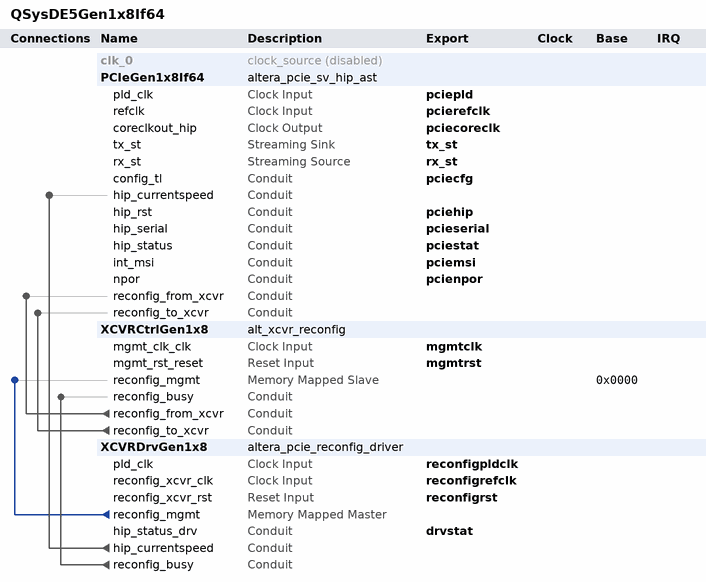
[diagram p0: system contents]
# Platform Designer (Qsys) system QSysDE5Gen1x8If64, Stratix V 5SGXEA7N2F45C2
# Parameters at their usual value, and those the tool derives, are not listed.
package require -exact qsys 14.1
create_system QSysDE5Gen1x8If64
set_project_property DEVICE_FAMILY {Stratix V}
set_project_property DEVICE 5SGXEA7N2F45C2

add_instance clk_0 clock_source 14.1
set_instance_property clk_0 ENABLED false
set_instance_parameter_value clk_0 clockFrequency 50000000

add_instance PCIeGen1x8If64 altera_pcie_sv_hip_ast 14.1
set_instance_parameter_value PCIeGen1x8If64 advanced_default_hwtcl_atomic_malformed true
set_instance_parameter_value PCIeGen1x8If64 advanced_default_hwtcl_atomic_op_completer_32bit false
set_instance_parameter_value PCIeGen1x8If64 advanced_default_hwtcl_atomic_op_completer_64bit false
set_instance_parameter_value PCIeGen1x8If64 advanced_default_hwtcl_atomic_op_routing false
set_instance_parameter_value PCIeGen1x8If64 advanced_default_hwtcl_bridge_port_ssid_support false
set_instance_parameter_value PCIeGen1x8If64 advanced_default_hwtcl_bridge_port_vga_enable false
set_instance_parameter_value PCIeGen1x8If64 advanced_default_hwtcl_bypass_cdc false
set_instance_parameter_value PCIeGen1x8If64 advanced_default_hwtcl_cas_completer_128bit false
set_instance_parameter_value PCIeGen1x8If64 advanced_default_hwtcl_cdc_dummy_insert_limit 11
set_instance_parameter_value PCIeGen1x8If64 advanced_default_hwtcl_d0_pme false
set_instance_parameter_value PCIeGen1x8If64 advanced_default_hwtcl_d1_pme false
set_instance_parameter_value PCIeGen1x8If64 advanced_default_hwtcl_d1_support false
set_instance_parameter_value PCIeGen1x8If64 advanced_default_hwtcl_d2_pme false
set_instance_parameter_value PCIeGen1x8If64 advanced_default_hwtcl_d2_support false
set_instance_parameter_value PCIeGen1x8If64 advanced_default_hwtcl_d3_cold_pme false
set_instance_parameter_value PCIeGen1x8If64 advanced_default_hwtcl_d3_hot_pme false
set_instance_parameter_value PCIeGen1x8If64 advanced_default_hwtcl_data_pack_rx disable
set_instance_parameter_value PCIeGen1x8If64 advanced_default_hwtcl_deskew_comma com_deskw
set_instance_parameter_value PCIeGen1x8If64 advanced_default_hwtcl_device_number 0
set_instance_parameter_value PCIeGen1x8If64 advanced_default_hwtcl_disable_link_x2_support false
set_instance_parameter_value PCIeGen1x8If64 advanced_default_hwtcl_disable_snoop_packet false
set_instance_parameter_value PCIeGen1x8If64 advanced_default_hwtcl_ei_delay_powerdown_count 10
set_instance_parameter_value PCIeGen1x8If64 advanced_default_hwtcl_eie_before_nfts_count 4
set_instance_parameter_value PCIeGen1x8If64 advanced_default_hwtcl_enable_adapter_half_rate_mode false
set_instance_parameter_value PCIeGen1x8If64 advanced_default_hwtcl_enable_l1_aspm false
set_instance_parameter_value PCIeGen1x8If64 advanced_default_hwtcl_enable_rx_buffer_checking false
set_instance_parameter_value PCIeGen1x8If64 advanced_default_hwtcl_extended_format_field false
set_instance_parameter_value PCIeGen1x8If64 advanced_default_hwtcl_extended_tag_reset false
set_instance_parameter_value PCIeGen1x8If64 advanced_default_hwtcl_fc_init_timer 1024
set_instance_parameter_value PCIeGen1x8If64 advanced_default_hwtcl_flow_control_timeout_count 200
set_instance_parameter_value PCIeGen1x8If64 advanced_default_hwtcl_flow_control_update_count 30
set_instance_parameter_value PCIeGen1x8If64 advanced_default_hwtcl_flr_capability false
set_instance_parameter_value PCIeGen1x8If64 advanced_default_hwtcl_gen2_diffclock_nfts_count 255
set_instance_parameter_value PCIeGen1x8If64 advanced_default_hwtcl_gen2_sameclock_nfts_count 255
set_instance_parameter_value PCIeGen1x8If64 advanced_default_hwtcl_hot_plug_support 0
set_instance_parameter_value PCIeGen1x8If64 advanced_default_hwtcl_interrupt_pin inta
set_instance_parameter_value PCIeGen1x8If64 advanced_default_hwtcl_l01_entry_latency 31
set_instance_parameter_value PCIeGen1x8If64 advanced_default_hwtcl_l0_exit_latency_diffclock 6
set_instance_parameter_value PCIeGen1x8If64 advanced_default_hwtcl_l0_exit_latency_sameclock 6
set_instance_parameter_value PCIeGen1x8If64 advanced_default_hwtcl_l1_exit_latency_diffclock 0
set_instance_parameter_value PCIeGen1x8If64 advanced_default_hwtcl_l1_exit_latency_sameclock 0
set_instance_parameter_value PCIeGen1x8If64 advanced_default_hwtcl_low_priority_vc single_vc
set_instance_parameter_value PCIeGen1x8If64 advanced_default_hwtcl_ltr_mechanism false
set_instance_parameter_value PCIeGen1x8If64 advanced_default_hwtcl_ltssm_1ms_timeout disable
set_instance_parameter_value PCIeGen1x8If64 advanced_default_hwtcl_ltssm_freqlocked_check disable
set_instance_parameter_value PCIeGen1x8If64 advanced_default_hwtcl_maximum_current 0
set_instance_parameter_value PCIeGen1x8If64 advanced_default_hwtcl_no_command_completed true
set_instance_parameter_value PCIeGen1x8If64 advanced_default_hwtcl_no_soft_reset false
set_instance_parameter_value PCIeGen1x8If64 advanced_default_hwtcl_pclk_out_sel pclk
set_instance_parameter_value PCIeGen1x8If64 advanced_default_hwtcl_pipex1_debug_sel disable
set_instance_parameter_value PCIeGen1x8If64 advanced_default_hwtcl_register_pipe_signals false
set_instance_parameter_value PCIeGen1x8If64 advanced_default_hwtcl_reserved_debug 0
set_instance_parameter_value PCIeGen1x8If64 advanced_default_hwtcl_retry_buffer_last_active_address 2047
set_instance_parameter_value PCIeGen1x8If64 advanced_default_hwtcl_rx_l0s_count_idl 0
set_instance_parameter_value PCIeGen1x8If64 advanced_default_hwtcl_set_l0s 0
set_instance_parameter_value PCIeGen1x8If64 advanced_default_hwtcl_skp_os_gen3_count 0
set_instance_parameter_value PCIeGen1x8If64 advanced_default_hwtcl_skp_os_schedule_count 0
set_instance_parameter_value PCIeGen1x8If64 advanced_default_hwtcl_ssid 0
set_instance_parameter_value PCIeGen1x8If64 advanced_default_hwtcl_ssvid 0
set_instance_parameter_value PCIeGen1x8If64 advanced_default_hwtcl_tph_completer false
set_instance_parameter_value PCIeGen1x8If64 advanced_default_hwtcl_tx_cdc_almost_empty 5
set_instance_parameter_value PCIeGen1x8If64 advanced_default_hwtcl_vc0_clk_enable true
set_instance_parameter_value PCIeGen1x8If64 advanced_default_hwtcl_wrong_device_id disable
set_instance_parameter_value PCIeGen1x8If64 advanced_default_parameter_override 0
set_instance_parameter_value PCIeGen1x8If64 ast_width_hwtcl {Avalon-ST 64-bit}
set_instance_parameter_value PCIeGen1x8If64 bar0_size_mask_hwtcl 10
set_instance_parameter_value PCIeGen1x8If64 bar0_type_hwtcl 2
set_instance_parameter_value PCIeGen1x8If64 bar1_size_mask_hwtcl 0
set_instance_parameter_value PCIeGen1x8If64 bar1_type_hwtcl 0
set_instance_parameter_value PCIeGen1x8If64 bar2_size_mask_hwtcl 0
set_instance_parameter_value PCIeGen1x8If64 bar2_type_hwtcl 0
set_instance_parameter_value PCIeGen1x8If64 bar3_size_mask_hwtcl 0
set_instance_parameter_value PCIeGen1x8If64 bar3_type_hwtcl 0
set_instance_parameter_value PCIeGen1x8If64 bar4_size_mask_hwtcl 0
set_instance_parameter_value PCIeGen1x8If64 bar4_type_hwtcl 0
set_instance_parameter_value PCIeGen1x8If64 bar5_size_mask_hwtcl 0
set_instance_parameter_value PCIeGen1x8If64 bar5_type_hwtcl 0
set_instance_parameter_value PCIeGen1x8If64 change_deemphasis_hwtcl 0
set_instance_parameter_value PCIeGen1x8If64 class_code_hwtcl 0
set_instance_parameter_value PCIeGen1x8If64 completion_timeout_hwtcl ABCD
set_instance_parameter_value PCIeGen1x8If64 design_environment_hwtcl QSYS
set_instance_parameter_value PCIeGen1x8If64 device_id_hwtcl 1
set_instance_parameter_value PCIeGen1x8If64 dll_active_report_support_hwtcl 0
set_instance_parameter_value PCIeGen1x8If64 ecrc_check_capable_hwtcl 0
set_instance_parameter_value PCIeGen1x8If64 ecrc_gen_capable_hwtcl 0
set_instance_parameter_value PCIeGen1x8If64 enable_completion_timeout_disable_hwtcl 1
set_instance_parameter_value PCIeGen1x8If64 enable_function_msix_support_hwtcl 0
set_instance_parameter_value PCIeGen1x8If64 enable_pcisigtest_hwtcl 0
set_instance_parameter_value PCIeGen1x8If64 enable_pipe32_phyip_ser_driver_hwtcl 0
set_instance_parameter_value PCIeGen1x8If64 enable_pipe32_sim_hwtcl 0
set_instance_parameter_value PCIeGen1x8If64 enable_power_on_rst_pulse_hwtcl 0
set_instance_parameter_value PCIeGen1x8If64 enable_slot_register_hwtcl 0
set_instance_parameter_value PCIeGen1x8If64 enable_tl_only_sim_hwtcl 0
set_instance_parameter_value PCIeGen1x8If64 endpoint_l0_latency_hwtcl 0
set_instance_parameter_value PCIeGen1x8If64 endpoint_l1_latency_hwtcl 0
set_instance_parameter_value PCIeGen1x8If64 expansion_base_address_register_hwtcl 0
set_instance_parameter_value PCIeGen1x8If64 extend_tag_field_hwtcl 64
set_instance_parameter_value PCIeGen1x8If64 fixed_preset_on 0
set_instance_parameter_value PCIeGen1x8If64 force_hrc 0
set_instance_parameter_value PCIeGen1x8If64 force_src 0
set_instance_parameter_value PCIeGen1x8If64 full_swing_hwtcl 35
set_instance_parameter_value PCIeGen1x8If64 gen123_lane_rate_mode_hwtcl {Gen1 (2.5 Gbps)}
set_instance_parameter_value PCIeGen1x8If64 gen3_coeff_10_ber_meas_hwtcl 0
set_instance_parameter_value PCIeGen1x8If64 gen3_coeff_10_hwtcl 0
set_instance_parameter_value PCIeGen1x8If64 gen3_coeff_10_nxtber_less_hwtcl g3_coeff_10_nxtber_less
set_instance_parameter_value PCIeGen1x8If64 gen3_coeff_10_nxtber_less_ptr_hwtcl 0
set_instance_parameter_value PCIeGen1x8If64 gen3_coeff_10_nxtber_more_hwtcl g3_coeff_10_nxtber_more
set_instance_parameter_value PCIeGen1x8If64 gen3_coeff_10_nxtber_more_ptr_hwtcl 0
set_instance_parameter_value PCIeGen1x8If64 gen3_coeff_10_preset_hint_hwtcl 0
set_instance_parameter_value PCIeGen1x8If64 gen3_coeff_10_reqber_hwtcl 0
set_instance_parameter_value PCIeGen1x8If64 gen3_coeff_10_sel_hwtcl preset_10
set_instance_parameter_value PCIeGen1x8If64 gen3_coeff_11_ber_meas_hwtcl 0
set_instance_parameter_value PCIeGen1x8If64 gen3_coeff_11_hwtcl 0
set_instance_parameter_value PCIeGen1x8If64 gen3_coeff_11_nxtber_less_hwtcl g3_coeff_11_nxtber_less
set_instance_parameter_value PCIeGen1x8If64 gen3_coeff_11_nxtber_less_ptr_hwtcl 0
set_instance_parameter_value PCIeGen1x8If64 gen3_coeff_11_nxtber_more_hwtcl g3_coeff_11_nxtber_more
set_instance_parameter_value PCIeGen1x8If64 gen3_coeff_11_nxtber_more_ptr_hwtcl 0
set_instance_parameter_value PCIeGen1x8If64 gen3_coeff_11_preset_hint_hwtcl 0
set_instance_parameter_value PCIeGen1x8If64 gen3_coeff_11_reqber_hwtcl 0
set_instance_parameter_value PCIeGen1x8If64 gen3_coeff_11_sel_hwtcl preset_11
set_instance_parameter_value PCIeGen1x8If64 gen3_coeff_12_ber_meas_hwtcl 0
set_instance_parameter_value PCIeGen1x8If64 gen3_coeff_12_hwtcl 0
set_instance_parameter_value PCIeGen1x8If64 gen3_coeff_12_nxtber_less_hwtcl g3_coeff_12_nxtber_less
set_instance_parameter_value PCIeGen1x8If64 gen3_coeff_12_nxtber_less_ptr_hwtcl 0
set_instance_parameter_value PCIeGen1x8If64 gen3_coeff_12_nxtber_more_hwtcl g3_coeff_12_nxtber_more
set_instance_parameter_value PCIeGen1x8If64 gen3_coeff_12_nxtber_more_ptr_hwtcl 0
set_instance_parameter_value PCIeGen1x8If64 gen3_coeff_12_preset_hint_hwtcl 0
set_instance_parameter_value PCIeGen1x8If64 gen3_coeff_12_reqber_hwtcl 0
set_instance_parameter_value PCIeGen1x8If64 gen3_coeff_12_sel_hwtcl preset_12
set_instance_parameter_value PCIeGen1x8If64 gen3_coeff_13_ber_meas_hwtcl 0
set_instance_parameter_value PCIeGen1x8If64 gen3_coeff_13_hwtcl 0
set_instance_parameter_value PCIeGen1x8If64 gen3_coeff_13_nxtber_less_hwtcl g3_coeff_13_nxtber_less
set_instance_parameter_value PCIeGen1x8If64 gen3_coeff_13_nxtber_less_ptr_hwtcl 0
set_instance_parameter_value PCIeGen1x8If64 gen3_coeff_13_nxtber_more_hwtcl g3_coeff_13_nxtber_more
set_instance_parameter_value PCIeGen1x8If64 gen3_coeff_13_nxtber_more_ptr_hwtcl 0
set_instance_parameter_value PCIeGen1x8If64 gen3_coeff_13_preset_hint_hwtcl 0
set_instance_parameter_value PCIeGen1x8If64 gen3_coeff_13_reqber_hwtcl 0
set_instance_parameter_value PCIeGen1x8If64 gen3_coeff_13_sel_hwtcl preset_13
set_instance_parameter_value PCIeGen1x8If64 gen3_coeff_14_ber_meas_hwtcl 0
set_instance_parameter_value PCIeGen1x8If64 gen3_coeff_14_hwtcl 0
set_instance_parameter_value PCIeGen1x8If64 gen3_coeff_14_nxtber_less_hwtcl g3_coeff_14_nxtber_less
set_instance_parameter_value PCIeGen1x8If64 gen3_coeff_14_nxtber_less_ptr_hwtcl 0
set_instance_parameter_value PCIeGen1x8If64 gen3_coeff_14_nxtber_more_hwtcl g3_coeff_14_nxtber_more
set_instance_parameter_value PCIeGen1x8If64 gen3_coeff_14_nxtber_more_ptr_hwtcl 0
set_instance_parameter_value PCIeGen1x8If64 gen3_coeff_14_preset_hint_hwtcl 0
set_instance_parameter_value PCIeGen1x8If64 gen3_coeff_14_reqber_hwtcl 0
set_instance_parameter_value PCIeGen1x8If64 gen3_coeff_14_sel_hwtcl preset_14
set_instance_parameter_value PCIeGen1x8If64 gen3_coeff_15_ber_meas_hwtcl 0
set_instance_parameter_value PCIeGen1x8If64 gen3_coeff_15_hwtcl 0
set_instance_parameter_value PCIeGen1x8If64 gen3_coeff_15_nxtber_less_hwtcl g3_coeff_15_nxtber_less
set_instance_parameter_value PCIeGen1x8If64 gen3_coeff_15_nxtber_less_ptr_hwtcl 0
set_instance_parameter_value PCIeGen1x8If64 gen3_coeff_15_nxtber_more_hwtcl g3_coeff_15_nxtber_more
set_instance_parameter_value PCIeGen1x8If64 gen3_coeff_15_nxtber_more_ptr_hwtcl 0
set_instance_parameter_value PCIeGen1x8If64 gen3_coeff_15_preset_hint_hwtcl 0
set_instance_parameter_value PCIeGen1x8If64 gen3_coeff_15_reqber_hwtcl 0
set_instance_parameter_value PCIeGen1x8If64 gen3_coeff_15_sel_hwtcl preset_15
set_instance_parameter_value PCIeGen1x8If64 gen3_coeff_16_ber_meas_hwtcl 0
set_instance_parameter_value PCIeGen1x8If64 gen3_coeff_16_hwtcl 0
set_instance_parameter_value PCIeGen1x8If64 gen3_coeff_16_nxtber_less_hwtcl g3_coeff_16_nxtber_less
set_instance_parameter_value PCIeGen1x8If64 gen3_coeff_16_nxtber_less_ptr_hwtcl 0
set_instance_parameter_value PCIeGen1x8If64 gen3_coeff_16_nxtber_more_hwtcl g3_coeff_16_nxtber_more
set_instance_parameter_value PCIeGen1x8If64 gen3_coeff_16_nxtber_more_ptr_hwtcl 0
set_instance_parameter_value PCIeGen1x8If64 gen3_coeff_16_preset_hint_hwtcl 0
set_instance_parameter_value PCIeGen1x8If64 gen3_coeff_16_reqber_hwtcl 0
set_instance_parameter_value PCIeGen1x8If64 gen3_coeff_16_sel_hwtcl preset_16
set_instance_parameter_value PCIeGen1x8If64 gen3_coeff_17_ber_meas_hwtcl 0
set_instance_parameter_value PCIeGen1x8If64 gen3_coeff_17_hwtcl 0
set_instance_parameter_value PCIeGen1x8If64 gen3_coeff_17_nxtber_less_hwtcl g3_coeff_17_nxtber_less
set_instance_parameter_value PCIeGen1x8If64 gen3_coeff_17_nxtber_less_ptr_hwtcl 0
set_instance_parameter_value PCIeGen1x8If64 gen3_coeff_17_nxtber_more_hwtcl g3_coeff_17_nxtber_more
set_instance_parameter_value PCIeGen1x8If64 gen3_coeff_17_nxtber_more_ptr_hwtcl 0
set_instance_parameter_value PCIeGen1x8If64 gen3_coeff_17_preset_hint_hwtcl 0
set_instance_parameter_value PCIeGen1x8If64 gen3_coeff_17_reqber_hwtcl 0
set_instance_parameter_value PCIeGen1x8If64 gen3_coeff_17_sel_hwtcl preset_17
set_instance_parameter_value PCIeGen1x8If64 gen3_coeff_18_ber_meas_hwtcl 0
set_instance_parameter_value PCIeGen1x8If64 gen3_coeff_18_hwtcl 0
set_instance_parameter_value PCIeGen1x8If64 gen3_coeff_18_nxtber_less_hwtcl g3_coeff_18_nxtber_less
set_instance_parameter_value PCIeGen1x8If64 gen3_coeff_18_nxtber_less_ptr_hwtcl 0
set_instance_parameter_value PCIeGen1x8If64 gen3_coeff_18_nxtber_more_hwtcl g3_coeff_18_nxtber_more
set_instance_parameter_value PCIeGen1x8If64 gen3_coeff_18_nxtber_more_ptr_hwtcl 0
set_instance_parameter_value PCIeGen1x8If64 gen3_coeff_18_preset_hint_hwtcl 0
set_instance_parameter_value PCIeGen1x8If64 gen3_coeff_18_reqber_hwtcl 0
set_instance_parameter_value PCIeGen1x8If64 gen3_coeff_18_sel_hwtcl preset_18
set_instance_parameter_value PCIeGen1x8If64 gen3_coeff_19_ber_meas_hwtcl 0
set_instance_parameter_value PCIeGen1x8If64 gen3_coeff_19_hwtcl 0
set_instance_parameter_value PCIeGen1x8If64 gen3_coeff_19_nxtber_less_hwtcl g3_coeff_19_nxtber_less
set_instance_parameter_value PCIeGen1x8If64 gen3_coeff_19_nxtber_less_ptr_hwtcl 0
set_instance_parameter_value PCIeGen1x8If64 gen3_coeff_19_nxtber_more_hwtcl g3_coeff_19_nxtber_more
set_instance_parameter_value PCIeGen1x8If64 gen3_coeff_19_nxtber_more_ptr_hwtcl 0
set_instance_parameter_value PCIeGen1x8If64 gen3_coeff_19_preset_hint_hwtcl 0
set_instance_parameter_value PCIeGen1x8If64 gen3_coeff_19_reqber_hwtcl 0
set_instance_parameter_value PCIeGen1x8If64 gen3_coeff_19_sel_hwtcl preset_19
set_instance_parameter_value PCIeGen1x8If64 gen3_coeff_1_ber_meas_hwtcl 2
set_instance_parameter_value PCIeGen1x8If64 gen3_coeff_1_hwtcl 7
set_instance_parameter_value PCIeGen1x8If64 gen3_coeff_1_nxtber_less_hwtcl g3_coeff_1_nxtber_less
set_instance_parameter_value PCIeGen1x8If64 gen3_coeff_1_nxtber_less_ptr_hwtcl 1
set_instance_parameter_value PCIeGen1x8If64 gen3_coeff_1_nxtber_more_hwtcl g3_coeff_1_nxtber_more
set_instance_parameter_value PCIeGen1x8If64 gen3_coeff_1_nxtber_more_ptr_hwtcl 1
set_instance_parameter_value PCIeGen1x8If64 gen3_coeff_1_preset_hint_hwtcl 0
set_instance_parameter_value PCIeGen1x8If64 gen3_coeff_1_reqber_hwtcl 0
set_instance_parameter_value PCIeGen1x8If64 gen3_coeff_1_sel_hwtcl preset_1
set_instance_parameter_value PCIeGen1x8If64 gen3_coeff_20_ber_meas_hwtcl 0
set_instance_parameter_value PCIeGen1x8If64 gen3_coeff_20_hwtcl 0
set_instance_parameter_value PCIeGen1x8If64 gen3_coeff_20_nxtber_less_hwtcl g3_coeff_20_nxtber_less
set_instance_parameter_value PCIeGen1x8If64 gen3_coeff_20_nxtber_less_ptr_hwtcl 0
set_instance_parameter_value PCIeGen1x8If64 gen3_coeff_20_nxtber_more_hwtcl g3_coeff_20_nxtber_more
set_instance_parameter_value PCIeGen1x8If64 gen3_coeff_20_nxtber_more_ptr_hwtcl 0
set_instance_parameter_value PCIeGen1x8If64 gen3_coeff_20_preset_hint_hwtcl 0
set_instance_parameter_value PCIeGen1x8If64 gen3_coeff_20_reqber_hwtcl 0
set_instance_parameter_value PCIeGen1x8If64 gen3_coeff_20_sel_hwtcl preset_20
set_instance_parameter_value PCIeGen1x8If64 gen3_coeff_21_ber_meas_hwtcl 0
set_instance_parameter_value PCIeGen1x8If64 gen3_coeff_21_hwtcl 0
set_instance_parameter_value PCIeGen1x8If64 gen3_coeff_21_nxtber_less_hwtcl g3_coeff_21_nxtber_less
set_instance_parameter_value PCIeGen1x8If64 gen3_coeff_21_nxtber_less_ptr_hwtcl 0
set_instance_parameter_value PCIeGen1x8If64 gen3_coeff_21_nxtber_more_hwtcl g3_coeff_21_nxtber_more
set_instance_parameter_value PCIeGen1x8If64 gen3_coeff_21_nxtber_more_ptr_hwtcl 0
set_instance_parameter_value PCIeGen1x8If64 gen3_coeff_21_preset_hint_hwtcl 0
set_instance_parameter_value PCIeGen1x8If64 gen3_coeff_21_reqber_hwtcl 0
set_instance_parameter_value PCIeGen1x8If64 gen3_coeff_21_sel_hwtcl preset_21
set_instance_parameter_value PCIeGen1x8If64 gen3_coeff_22_ber_meas_hwtcl 0
set_instance_parameter_value PCIeGen1x8If64 gen3_coeff_22_hwtcl 0
set_instance_parameter_value PCIeGen1x8If64 gen3_coeff_22_nxtber_less_hwtcl g3_coeff_22_nxtber_less
set_instance_parameter_value PCIeGen1x8If64 gen3_coeff_22_nxtber_less_ptr_hwtcl 0
set_instance_parameter_value PCIeGen1x8If64 gen3_coeff_22_nxtber_more_hwtcl g3_coeff_22_nxtber_more
set_instance_parameter_value PCIeGen1x8If64 gen3_coeff_22_nxtber_more_ptr_hwtcl 0
set_instance_parameter_value PCIeGen1x8If64 gen3_coeff_22_preset_hint_hwtcl 0
set_instance_parameter_value PCIeGen1x8If64 gen3_coeff_22_reqber_hwtcl 0
set_instance_parameter_value PCIeGen1x8If64 gen3_coeff_22_sel_hwtcl preset_22
set_instance_parameter_value PCIeGen1x8If64 gen3_coeff_23_ber_meas_hwtcl 0
set_instance_parameter_value PCIeGen1x8If64 gen3_coeff_23_hwtcl 0
set_instance_parameter_value PCIeGen1x8If64 gen3_coeff_23_nxtber_less_hwtcl g3_coeff_23_nxtber_less
set_instance_parameter_value PCIeGen1x8If64 gen3_coeff_23_nxtber_less_ptr_hwtcl 0
set_instance_parameter_value PCIeGen1x8If64 gen3_coeff_23_nxtber_more_hwtcl g3_coeff_23_nxtber_more
set_instance_parameter_value PCIeGen1x8If64 gen3_coeff_23_nxtber_more_ptr_hwtcl 0
set_instance_parameter_value PCIeGen1x8If64 gen3_coeff_23_preset_hint_hwtcl 0
set_instance_parameter_value PCIeGen1x8If64 gen3_coeff_23_reqber_hwtcl 0
set_instance_parameter_value PCIeGen1x8If64 gen3_coeff_23_sel_hwtcl preset_23
set_instance_parameter_value PCIeGen1x8If64 gen3_coeff_24_ber_meas_hwtcl 0
set_instance_parameter_value PCIeGen1x8If64 gen3_coeff_24_hwtcl 0
set_instance_parameter_value PCIeGen1x8If64 gen3_coeff_24_nxtber_less_hwtcl g3_coeff_24_nxtber_less
set_instance_parameter_value PCIeGen1x8If64 gen3_coeff_24_nxtber_less_ptr_hwtcl 0
set_instance_parameter_value PCIeGen1x8If64 gen3_coeff_24_nxtber_more_hwtcl g3_coeff_24_nxtber_more
set_instance_parameter_value PCIeGen1x8If64 gen3_coeff_24_nxtber_more_ptr_hwtcl 0
set_instance_parameter_value PCIeGen1x8If64 gen3_coeff_24_preset_hint_hwtcl 0
set_instance_parameter_value PCIeGen1x8If64 gen3_coeff_24_reqber_hwtcl 0
set_instance_parameter_value PCIeGen1x8If64 gen3_coeff_24_sel_hwtcl preset_24
set_instance_parameter_value PCIeGen1x8If64 gen3_coeff_2_ber_meas_hwtcl 0
set_instance_parameter_value PCIeGen1x8If64 gen3_coeff_2_hwtcl 0
set_instance_parameter_value PCIeGen1x8If64 gen3_coeff_2_nxtber_less_hwtcl g3_coeff_2_nxtber_less
set_instance_parameter_value PCIeGen1x8If64 gen3_coeff_2_nxtber_less_ptr_hwtcl 0
set_instance_parameter_value PCIeGen1x8If64 gen3_coeff_2_nxtber_more_hwtcl g3_coeff_2_nxtber_more
set_instance_parameter_value PCIeGen1x8If64 gen3_coeff_2_nxtber_more_ptr_hwtcl 0
set_instance_parameter_value PCIeGen1x8If64 gen3_coeff_2_preset_hint_hwtcl 0
set_instance_parameter_value PCIeGen1x8If64 gen3_coeff_2_reqber_hwtcl 0
set_instance_parameter_value PCIeGen1x8If64 gen3_coeff_2_sel_hwtcl preset_2
set_instance_parameter_value PCIeGen1x8If64 gen3_coeff_3_ber_meas_hwtcl 0
set_instance_parameter_value PCIeGen1x8If64 gen3_coeff_3_hwtcl 0
set_instance_parameter_value PCIeGen1x8If64 gen3_coeff_3_nxtber_less_hwtcl g3_coeff_3_nxtber_less
set_instance_parameter_value PCIeGen1x8If64 gen3_coeff_3_nxtber_less_ptr_hwtcl 0
set_instance_parameter_value PCIeGen1x8If64 gen3_coeff_3_nxtber_more_hwtcl g3_coeff_3_nxtber_more
set_instance_parameter_value PCIeGen1x8If64 gen3_coeff_3_nxtber_more_ptr_hwtcl 0
set_instance_parameter_value PCIeGen1x8If64 gen3_coeff_3_preset_hint_hwtcl 0
set_instance_parameter_value PCIeGen1x8If64 gen3_coeff_3_reqber_hwtcl 0
set_instance_parameter_value PCIeGen1x8If64 gen3_coeff_3_sel_hwtcl preset_3
set_instance_parameter_value PCIeGen1x8If64 gen3_coeff_4_ber_meas_hwtcl 0
set_instance_parameter_value PCIeGen1x8If64 gen3_coeff_4_hwtcl 0
set_instance_parameter_value PCIeGen1x8If64 gen3_coeff_4_nxtber_less_hwtcl g3_coeff_4_nxtber_less
set_instance_parameter_value PCIeGen1x8If64 gen3_coeff_4_nxtber_less_ptr_hwtcl 0
set_instance_parameter_value PCIeGen1x8If64 gen3_coeff_4_nxtber_more_hwtcl g3_coeff_4_nxtber_more
set_instance_parameter_value PCIeGen1x8If64 gen3_coeff_4_nxtber_more_ptr_hwtcl 0
set_instance_parameter_value PCIeGen1x8If64 gen3_coeff_4_preset_hint_hwtcl 0
set_instance_parameter_value PCIeGen1x8If64 gen3_coeff_4_reqber_hwtcl 0
set_instance_parameter_value PCIeGen1x8If64 gen3_coeff_4_sel_hwtcl preset_4
set_instance_parameter_value PCIeGen1x8If64 gen3_coeff_5_ber_meas_hwtcl 0
set_instance_parameter_value PCIeGen1x8If64 gen3_coeff_5_hwtcl 0
set_instance_parameter_value PCIeGen1x8If64 gen3_coeff_5_nxtber_less_hwtcl g3_coeff_5_nxtber_less
set_instance_parameter_value PCIeGen1x8If64 gen3_coeff_5_nxtber_less_ptr_hwtcl 0
set_instance_parameter_value PCIeGen1x8If64 gen3_coeff_5_nxtber_more_hwtcl g3_coeff_5_nxtber_more
set_instance_parameter_value PCIeGen1x8If64 gen3_coeff_5_nxtber_more_ptr_hwtcl 0
set_instance_parameter_value PCIeGen1x8If64 gen3_coeff_5_preset_hint_hwtcl 0
set_instance_parameter_value PCIeGen1x8If64 gen3_coeff_5_reqber_hwtcl 0
set_instance_parameter_value PCIeGen1x8If64 gen3_coeff_5_sel_hwtcl preset_5
set_instance_parameter_value PCIeGen1x8If64 gen3_coeff_6_ber_meas_hwtcl 0
set_instance_parameter_value PCIeGen1x8If64 gen3_coeff_6_hwtcl 0
set_instance_parameter_value PCIeGen1x8If64 gen3_coeff_6_nxtber_less_hwtcl g3_coeff_6_nxtber_less
set_instance_parameter_value PCIeGen1x8If64 gen3_coeff_6_nxtber_less_ptr_hwtcl 0
set_instance_parameter_value PCIeGen1x8If64 gen3_coeff_6_nxtber_more_hwtcl g3_coeff_6_nxtber_more
set_instance_parameter_value PCIeGen1x8If64 gen3_coeff_6_nxtber_more_ptr_hwtcl 0
set_instance_parameter_value PCIeGen1x8If64 gen3_coeff_6_preset_hint_hwtcl 0
set_instance_parameter_value PCIeGen1x8If64 gen3_coeff_6_reqber_hwtcl 0
set_instance_parameter_value PCIeGen1x8If64 gen3_coeff_6_sel_hwtcl preset_6
set_instance_parameter_value PCIeGen1x8If64 gen3_coeff_7_ber_meas_hwtcl 0
set_instance_parameter_value PCIeGen1x8If64 gen3_coeff_7_hwtcl 0
set_instance_parameter_value PCIeGen1x8If64 gen3_coeff_7_nxtber_less_hwtcl g3_coeff_7_nxtber_less
set_instance_parameter_value PCIeGen1x8If64 gen3_coeff_7_nxtber_less_ptr_hwtcl 0
set_instance_parameter_value PCIeGen1x8If64 gen3_coeff_7_nxtber_more_hwtcl g3_coeff_7_nxtber_more
set_instance_parameter_value PCIeGen1x8If64 gen3_coeff_7_nxtber_more_ptr_hwtcl 0
set_instance_parameter_value PCIeGen1x8If64 gen3_coeff_7_preset_hint_hwtcl 0
set_instance_parameter_value PCIeGen1x8If64 gen3_coeff_7_reqber_hwtcl 0
set_instance_parameter_value PCIeGen1x8If64 gen3_coeff_7_sel_hwtcl preset_7
set_instance_parameter_value PCIeGen1x8If64 gen3_coeff_8_ber_meas_hwtcl 0
set_instance_parameter_value PCIeGen1x8If64 gen3_coeff_8_hwtcl 0
set_instance_parameter_value PCIeGen1x8If64 gen3_coeff_8_nxtber_less_hwtcl g3_coeff_8_nxtber_less
set_instance_parameter_value PCIeGen1x8If64 gen3_coeff_8_nxtber_less_ptr_hwtcl 0
set_instance_parameter_value PCIeGen1x8If64 gen3_coeff_8_nxtber_more_hwtcl g3_coeff_8_nxtber_more
set_instance_parameter_value PCIeGen1x8If64 gen3_coeff_8_nxtber_more_ptr_hwtcl 0
set_instance_parameter_value PCIeGen1x8If64 gen3_coeff_8_preset_hint_hwtcl 0
set_instance_parameter_value PCIeGen1x8If64 gen3_coeff_8_reqber_hwtcl 0
set_instance_parameter_value PCIeGen1x8If64 gen3_coeff_8_sel_hwtcl preset_8
set_instance_parameter_value PCIeGen1x8If64 gen3_coeff_9_ber_meas_hwtcl 0
set_instance_parameter_value PCIeGen1x8If64 gen3_coeff_9_hwtcl 0
set_instance_parameter_value PCIeGen1x8If64 gen3_coeff_9_nxtber_less_hwtcl g3_coeff_9_nxtber_less
set_instance_parameter_value PCIeGen1x8If64 gen3_coeff_9_nxtber_less_ptr_hwtcl 0
set_instance_parameter_value PCIeGen1x8If64 gen3_coeff_9_nxtber_more_hwtcl g3_coeff_9_nxtber_more
set_instance_parameter_value PCIeGen1x8If64 gen3_coeff_9_nxtber_more_ptr_hwtcl 0
set_instance_parameter_value PCIeGen1x8If64 gen3_coeff_9_preset_hint_hwtcl 0
set_instance_parameter_value PCIeGen1x8If64 gen3_coeff_9_reqber_hwtcl 0
set_instance_parameter_value PCIeGen1x8If64 gen3_coeff_9_sel_hwtcl preset_9
set_instance_parameter_value PCIeGen1x8If64 gen3_full_swing_hwtcl 35
set_instance_parameter_value PCIeGen1x8If64 gen3_low_freq_hwtcl 0
set_instance_parameter_value PCIeGen1x8If64 gen3_preset_coeff_10_hwtcl 0
set_instance_parameter_value PCIeGen1x8If64 gen3_preset_coeff_11_hwtcl 0
set_instance_parameter_value PCIeGen1x8If64 gen3_preset_coeff_1_hwtcl 0
set_instance_parameter_value PCIeGen1x8If64 gen3_preset_coeff_2_hwtcl 0
set_instance_parameter_value PCIeGen1x8If64 gen3_preset_coeff_3_hwtcl 0
set_instance_parameter_value PCIeGen1x8If64 gen3_preset_coeff_4_hwtcl 0
set_instance_parameter_value PCIeGen1x8If64 gen3_preset_coeff_5_hwtcl 0
set_instance_parameter_value PCIeGen1x8If64 gen3_preset_coeff_6_hwtcl 0
set_instance_parameter_value PCIeGen1x8If64 gen3_preset_coeff_7_hwtcl 0
set_instance_parameter_value PCIeGen1x8If64 gen3_preset_coeff_8_hwtcl 0
set_instance_parameter_value PCIeGen1x8If64 gen3_preset_coeff_9_hwtcl 0
set_instance_parameter_value PCIeGen1x8If64 gen3_rxfreqlock_counter_hwtcl 0
set_instance_parameter_value PCIeGen1x8If64 hip_reconfig_hwtcl 0
set_instance_parameter_value PCIeGen1x8If64 hip_tag_checking_hwtcl 1
set_instance_parameter_value PCIeGen1x8If64 hwtcl_override_g2_txvod 1
set_instance_parameter_value PCIeGen1x8If64 hwtcl_override_g3rxcoef 0
set_instance_parameter_value PCIeGen1x8If64 hwtcl_override_g3txcoef 0
set_instance_parameter_value PCIeGen1x8If64 in_cvp_mode_hwtcl 0
set_instance_parameter_value PCIeGen1x8If64 io_window_addr_width_hwtcl 0
set_instance_parameter_value PCIeGen1x8If64 lane_mask_hwtcl x8
set_instance_parameter_value PCIeGen1x8If64 low_latency_mode_hwtcl 0
set_instance_parameter_value PCIeGen1x8If64 max_payload_size_hwtcl 256
set_instance_parameter_value PCIeGen1x8If64 msi_64bit_addressing_capable_hwtcl true
set_instance_parameter_value PCIeGen1x8If64 msi_masking_capable_hwtcl false
set_instance_parameter_value PCIeGen1x8If64 msi_multi_message_capable_hwtcl 1
set_instance_parameter_value PCIeGen1x8If64 msi_support_hwtcl true
set_instance_parameter_value PCIeGen1x8If64 msix_pba_bir_hwtcl 0
set_instance_parameter_value PCIeGen1x8If64 msix_pba_offset_hwtcl 0
set_instance_parameter_value PCIeGen1x8If64 msix_table_bir_hwtcl 0
set_instance_parameter_value PCIeGen1x8If64 msix_table_offset_hwtcl 0
set_instance_parameter_value PCIeGen1x8If64 msix_table_size_hwtcl 0
set_instance_parameter_value PCIeGen1x8If64 multiple_packets_per_cycle_hwtcl 0
set_instance_parameter_value PCIeGen1x8If64 override_rxbuffer_cred_preset 0
set_instance_parameter_value PCIeGen1x8If64 override_tbpartner_driver_setting_hwtcl 0
set_instance_parameter_value PCIeGen1x8If64 pcie_inspector_hwtcl 0
set_instance_parameter_value PCIeGen1x8If64 pcie_qsys 1
set_instance_parameter_value PCIeGen1x8If64 pcie_spec_version_hwtcl 2.1
set_instance_parameter_value PCIeGen1x8If64 pll_refclk_freq_hwtcl {100 MHz}
set_instance_parameter_value PCIeGen1x8If64 port_link_number_hwtcl 1
set_instance_parameter_value PCIeGen1x8If64 port_type_hwtcl {Native endpoint}
set_instance_parameter_value PCIeGen1x8If64 prefetchable_mem_window_addr_width_hwtcl 0
set_instance_parameter_value PCIeGen1x8If64 revision_id_hwtcl 1
set_instance_parameter_value PCIeGen1x8If64 rpre_emph_a_val_hwtcl 9
set_instance_parameter_value PCIeGen1x8If64 rpre_emph_b_val_hwtcl 0
set_instance_parameter_value PCIeGen1x8If64 rpre_emph_c_val_hwtcl 16
set_instance_parameter_value PCIeGen1x8If64 rpre_emph_d_val_hwtcl 13
set_instance_parameter_value PCIeGen1x8If64 rpre_emph_e_val_hwtcl 5
set_instance_parameter_value PCIeGen1x8If64 rvod_sel_a_val_hwtcl 42
set_instance_parameter_value PCIeGen1x8If64 rvod_sel_b_val_hwtcl 38
set_instance_parameter_value PCIeGen1x8If64 rvod_sel_c_val_hwtcl 38
set_instance_parameter_value PCIeGen1x8If64 rvod_sel_d_val_hwtcl 43
set_instance_parameter_value PCIeGen1x8If64 rvod_sel_e_val_hwtcl 15
set_instance_parameter_value PCIeGen1x8If64 rxbuffer_rxreq_hwtcl Minimum
set_instance_parameter_value PCIeGen1x8If64 serial_sim_hwtcl 1
set_instance_parameter_value PCIeGen1x8If64 set_pld_clk_x1_625MHz_hwtcl 0
set_instance_parameter_value PCIeGen1x8If64 slot_number_hwtcl 0
set_instance_parameter_value PCIeGen1x8If64 slot_power_limit_hwtcl 0
set_instance_parameter_value PCIeGen1x8If64 slot_power_scale_hwtcl 0
set_instance_parameter_value PCIeGen1x8If64 slotclkcfg_hwtcl 1
set_instance_parameter_value PCIeGen1x8If64 subsystem_device_id_hwtcl 0
set_instance_parameter_value PCIeGen1x8If64 subsystem_vendor_id_hwtcl 0
set_instance_parameter_value PCIeGen1x8If64 surprise_down_error_support_hwtcl 0
set_instance_parameter_value PCIeGen1x8If64 tlp_insp_trg_dw0_hwtcl 2049
set_instance_parameter_value PCIeGen1x8If64 tlp_insp_trg_dw1_hwtcl 0
set_instance_parameter_value PCIeGen1x8If64 tlp_insp_trg_dw2_hwtcl 0
set_instance_parameter_value PCIeGen1x8If64 tlp_insp_trg_dw3_hwtcl 0
set_instance_parameter_value PCIeGen1x8If64 tlp_inspector_hwtcl 0
set_instance_parameter_value PCIeGen1x8If64 tlp_inspector_use_signal_probe_hwtcl 0
set_instance_parameter_value PCIeGen1x8If64 track_rxfc_cplbuf_ovf_hwtcl 0
set_instance_parameter_value PCIeGen1x8If64 use_aer_hwtcl 0
set_instance_parameter_value PCIeGen1x8If64 use_ast_parity 0
set_instance_parameter_value PCIeGen1x8If64 use_atx_pll_hwtcl 0
set_instance_parameter_value PCIeGen1x8If64 use_config_bypass_hwtcl 0
set_instance_parameter_value PCIeGen1x8If64 use_crc_forwarding_hwtcl 0
set_instance_parameter_value PCIeGen1x8If64 use_cvp_update_core_pof_hwtcl 0
set_instance_parameter_value PCIeGen1x8If64 use_pci_ext_hwtcl 0
set_instance_parameter_value PCIeGen1x8If64 use_pcie_ext_hwtcl 0
set_instance_parameter_value PCIeGen1x8If64 use_rx_st_be_hwtcl 0
set_instance_parameter_value PCIeGen1x8If64 use_tx_cons_cred_sel_hwtcl 0
set_instance_parameter_value PCIeGen1x8If64 user_id_hwtcl 0
set_instance_parameter_value PCIeGen1x8If64 vendor_id_hwtcl 4466
set_instance_parameter_value PCIeGen1x8If64 vsec_id_hwtcl 40960
set_instance_parameter_value PCIeGen1x8If64 vsec_rev_hwtcl 0

add_instance XCVRCtrlGen1x8 alt_xcvr_reconfig 14.1
set_instance_parameter_value XCVRCtrlGen1x8 device_family {Stratix V}
set_instance_parameter_value XCVRCtrlGen1x8 enable_adce 0
set_instance_parameter_value XCVRCtrlGen1x8 enable_analog 1
set_instance_parameter_value XCVRCtrlGen1x8 number_of_reconfig_interfaces 10

add_instance XCVRDrvGen1x8 altera_pcie_reconfig_driver 14.1
set_instance_parameter_value XCVRDrvGen1x8 gen123_lane_rate_mode_hwtcl {Gen1 (2.5 Gbps)}
set_instance_parameter_value XCVRDrvGen1x8 number_of_reconfig_interfaces 10

# connections
add_connection XCVRDrvGen1x8.reconfig_mgmt XCVRCtrlGen1x8.reconfig_mgmt avalon
set_connection_parameter_value XCVRDrvGen1x8.reconfig_mgmt/XCVRCtrlGen1x8.reconfig_mgmt baseAddress 0x0000
add_connection XCVRCtrlGen1x8.reconfig_from_xcvr PCIeGen1x8If64.reconfig_from_xcvr conduit
add_connection XCVRCtrlGen1x8.reconfig_to_xcvr PCIeGen1x8If64.reconfig_to_xcvr conduit
add_connection XCVRDrvGen1x8.hip_currentspeed PCIeGen1x8If64.hip_currentspeed conduit
add_connection XCVRDrvGen1x8.reconfig_busy XCVRCtrlGen1x8.reconfig_busy conduit

# exported interfaces
add_interface drvstat conduit end
set_interface_property drvstat EXPORT_OF XCVRDrvGen1x8.hip_status_drv
add_interface mgmtclk clock sink
set_interface_property mgmtclk EXPORT_OF XCVRCtrlGen1x8.mgmt_clk_clk
add_interface mgmtrst reset sink
set_interface_property mgmtrst EXPORT_OF XCVRCtrlGen1x8.mgmt_rst_reset
add_interface pciecfg conduit end
set_interface_property pciecfg EXPORT_OF PCIeGen1x8If64.config_tl
add_interface pciecoreclk clock source
set_interface_property pciecoreclk EXPORT_OF PCIeGen1x8If64.coreclkout_hip
add_interface pciehip conduit end
set_interface_property pciehip EXPORT_OF PCIeGen1x8If64.hip_rst
add_interface pciemsi conduit end
set_interface_property pciemsi EXPORT_OF PCIeGen1x8If64.int_msi
add_interface pcienpor conduit end
set_interface_property pcienpor EXPORT_OF PCIeGen1x8If64.npor
add_interface pciepld clock sink
set_interface_property pciepld EXPORT_OF PCIeGen1x8If64.pld_clk
add_interface pcierefclk clock sink
set_interface_property pcierefclk EXPORT_OF PCIeGen1x8If64.refclk
add_interface pcieserial conduit end
set_interface_property pcieserial EXPORT_OF PCIeGen1x8If64.hip_serial
add_interface pciestat conduit end
set_interface_property pciestat EXPORT_OF PCIeGen1x8If64.hip_status
add_interface reconfigpldclk clock sink
set_interface_property reconfigpldclk EXPORT_OF XCVRDrvGen1x8.pld_clk
add_interface reconfigrefclk clock sink
set_interface_property reconfigrefclk EXPORT_OF XCVRDrvGen1x8.reconfig_xcvr_clk
add_interface reconfigrst reset sink
set_interface_property reconfigrst EXPORT_OF XCVRDrvGen1x8.reconfig_xcvr_rst
add_interface rx_st avalon_streaming source
set_interface_property rx_st EXPORT_OF PCIeGen1x8If64.rx_st
add_interface tx_st avalon_streaming sink
set_interface_property tx_st EXPORT_OF PCIeGen1x8If64.tx_st

set_interconnect_requirement {$system} qsys_mm.clockCrossingAdapter HANDSHAKE
set_interconnect_requirement {$system} qsys_mm.insertDefaultSlave false
set_interconnect_requirement {$system} qsys_mm.maxAdditionalLatency 1

save_system QSysDE5Gen1x8If64.qsys
